# EAGLE schematic SmartLEDShield_ESP32_THT_V0 (EAGLE 8.6.3)
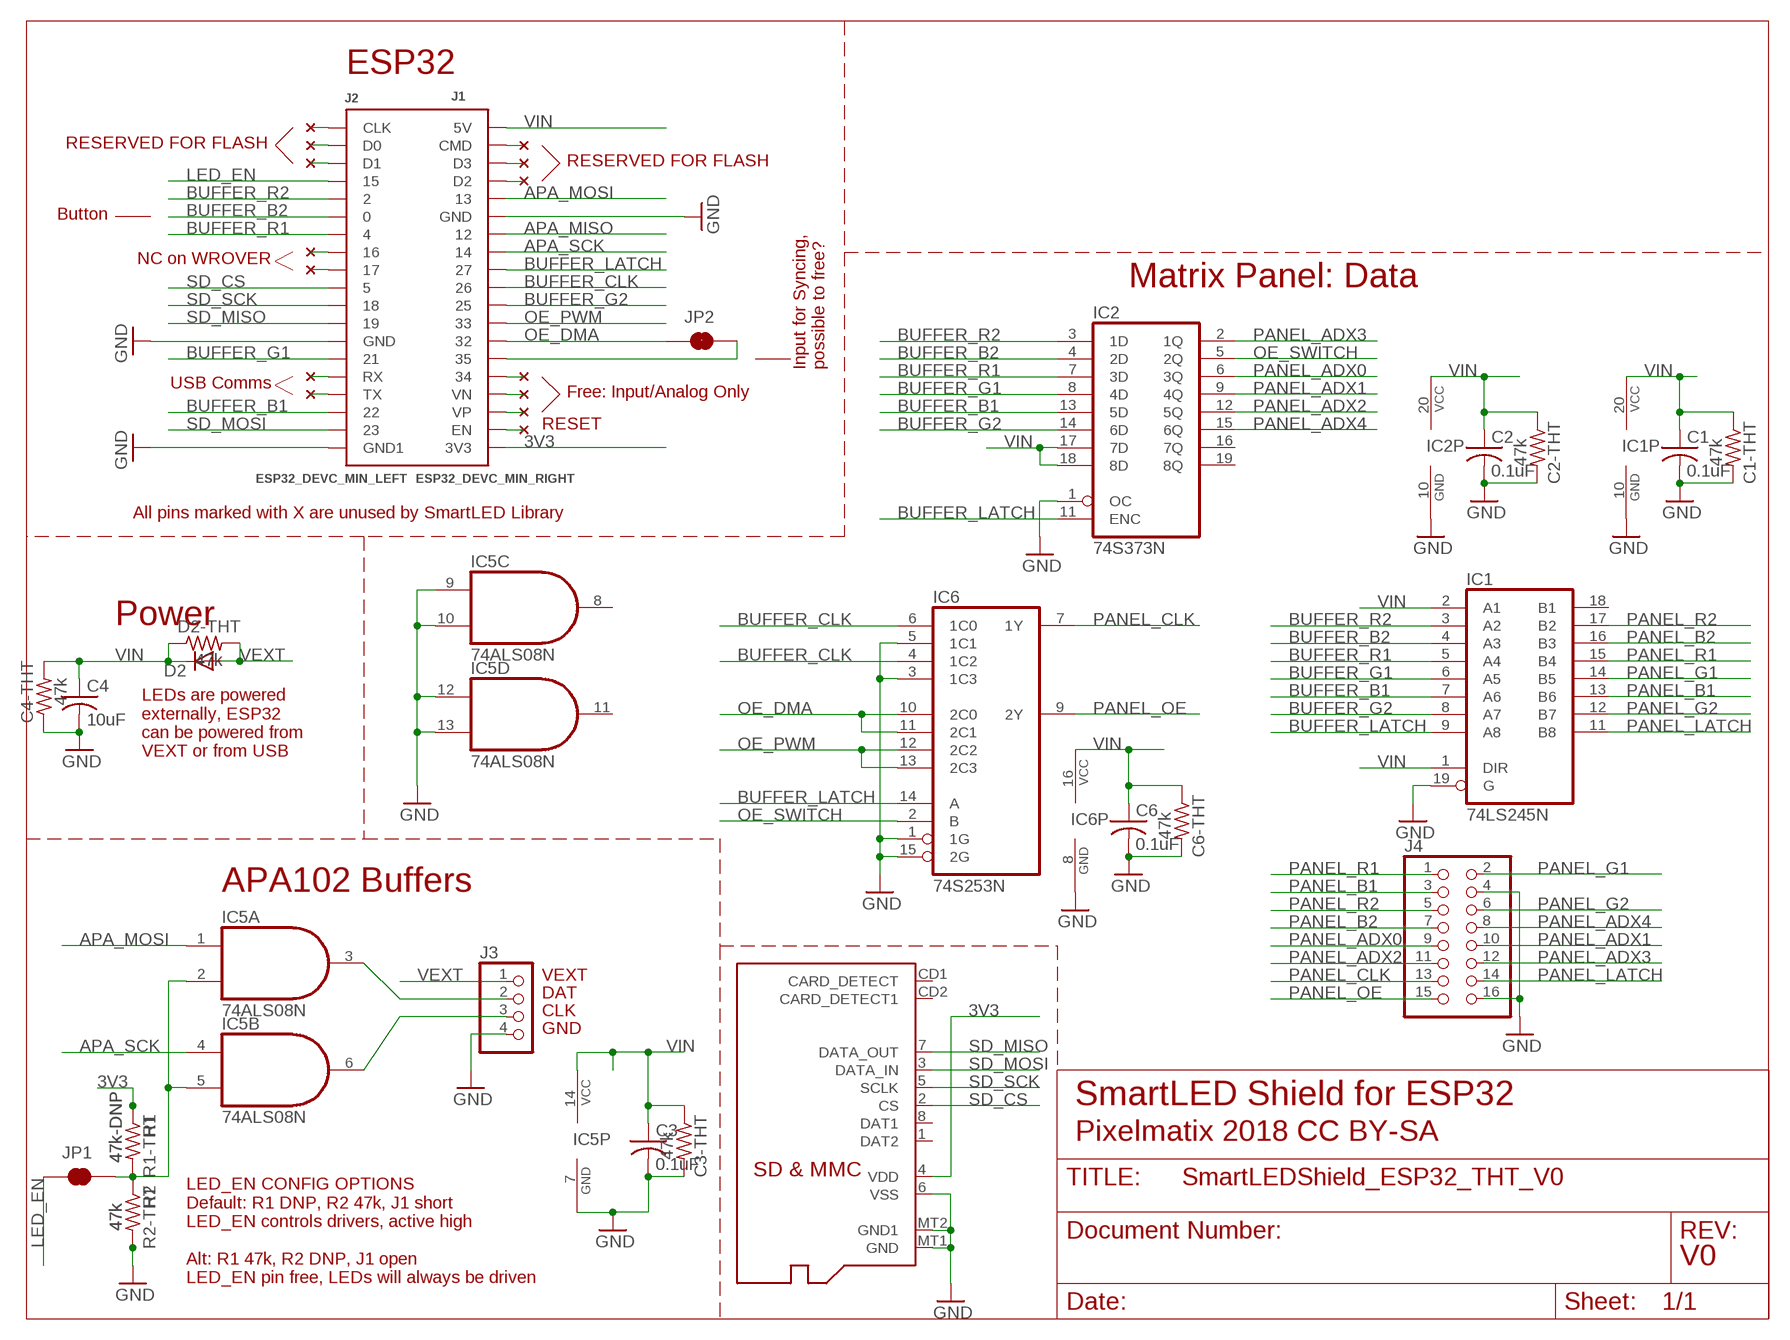
[diagram p0: schematic, sheet 1]

## Parts
C1  0.1uF  C-USC0603  [C0603]
C1-THT  47k  R-US_0204/7  [0204/7]
C2  0.1uF  C-USC0603  [C0603]
C2-THT  47k  R-US_0204/7  [0204/7]
C3  0.1uF  C-USC0603  [C0603]
C3-THT  47k  R-US_0204/7  [0204/7]
C4  10uF  C-USC0805  [C0805]
C4-THT  47k  R-US_0204/7  [0204/7]
C6  0.1uF  C-USC0603  [C0603]
C6-THT  47k  R-US_0204/7  [0204/7]
D2  MBR1020VL  [SOD123-FL]
D2-THT  47k  R-US_0204/7  [0204/7]
IC1  74LS245N  [DIL20]
IC2  74S373N  [DIL20]
IC5  74ALS08N  [DIL14]
IC6  74S253N  [DIL16]
J1  ESP32_DEVC_MIN_RIGHT  [ESP32_DEVC_DUAL_HEADER_BOT_MOUNT_RIGHT]
J2  ESP32_DEVC_MIN_LEFT  [ESP32_DEVC_DUAL_HEADER_BOT_MOUNT_LEFT]
J3  PINHD-1X04_2.54-S  [1X04-S]
J4  PINHD-2X08_SMARTMATRIX_SSMTHT  [SMARTMATRIX_SSMTHT]
J6  MICROSD  [MICROSD]
JP1  JUMPER-SMT_2_NC_TRACE_NO-SILK  [SMT-JUMPER_2_NC_TRACE_NO-SILK]
JP2  JUMPER-SMT_2_NC_TRACE_NO-SILK  [SMT-JUMPER_2_NC_TRACE_NO-SILK]
R1  47k-DNP  R-US_R0603  [R0603]
R1-THT  47k-DNP  R-US_0204/7  [0204/7]
R2  47k  R-US_R0603  [R0603]
R2-THT  47k  R-US_0204/7  [0204/7]
U$1  NC  (no package)
U$2  NC  (no package)
U$3  NC  (no package)
U$4  NC  (no package)
U$6  NC  (no package)
U$7  NC  (no package)
U$8  NC  (no package)
U$9  NC  (no package)
U$10  NC  (no package)
U$11  NC  (no package)
U$13  NC  (no package)
U$15  NC  (no package)
U$16  NC  (no package)
U$17  NC  (no package)

## Nets
3V3 [power]: J1.3V3A(3V3) J1.3V3B(3V3) J6.4(VDD) R1-THT.1 R1.1
APA_MISO: J1.12A J1.12B
APA_MOSI: IC5.1(A:I0) J1.13A_A J1.13B_B
APA_SCK: IC5.4(B:I0) J1.14A_A J1.14B_B
BUFFER_B1: IC1.7(A6) IC2.13(5D) J2.22A J2.22B
BUFFER_B2: IC1.4(A3) IC2.4(2D) J2.0A J2.0B
BUFFER_CLK: IC6.4(1C2) IC6.6(1C0) J1.26A J1.26B
BUFFER_G1: IC1.6(A5) IC2.8(4D) J2.21A J2.21B
BUFFER_G2: IC1.8(A7) IC2.14(6D) J1.25A J1.25B
BUFFER_LATCH: IC1.9(A8) IC2.11(ENC) IC6.14(A) J1.27A J1.27B
BUFFER_R1: IC1.5(A4) IC2.7(3D) J2.4A J2.4B
BUFFER_R2: IC1.3(A2) IC2.3(1D) J2.2A J2.2B
CLK1: IC5.6(B:O) J3.3
DAT1: IC5.3(A:O) J3.2
GND [power]: C1-THT.2 C1.2 C2-THT.2 C2.2 C3-THT.2 C3.2 C4-THT.1 C4.2 C6-THT.2 C6.2 IC1.10(GND) IC1.19(G) IC2.1(OC) IC2.10(GND) IC5.7(P:GND) IC5.9(C:I0) IC5.10(C:I1) IC5.12(D:I0) IC5.13(D:I1) IC6.1(1G) IC6.3(1C3) IC6.5(1C1) IC6.8(GND) IC6.15(2G) J1.GNDA(GND) J1.GNDB(GND) J2.GND1A(GND1) J2.GND1B(GND1) J2.GNDA(GND) J2.GNDB(GND) J3.4 J4.4 J4.16 J6.6(VSS) J6.MT1(GND) J6.MT2(GND1) R2-THT.2 R2.2
LED_EN: J2.15A_A J2.15B_B JP1.1
N$1: J1.35A J1.35B JP2.2
N$2: J1.CMD_A(CMD) J1.CMD_B(CMD) U$1.P$1
N$3: J1.D3_A(D3) J1.D3_B(D3) U$2.P$1
N$4: IC5.2(A:I1) IC5.5(B:I1) JP1.2 R1-THT.2 R1.2 R2-THT.1 R2.1
N$5: J1.D2A(D2) J1.D2B(D2) U$3.P$1
N$6: J2.CLKA(CLK) J2.CLKB(CLK) U$4.P$1
N$7: J2.D0A(D0) J2.D0B(D0) U$6.P$1
N$8: J2.D1A(D1) J2.D1B(D1) U$7.P$1
N$9: J1.VNA(VN) J1.VNB(VN) U$8.P$1
N$10: J1.VPA(VP) J1.VPB(VP) U$9.P$1
N$11: J1.34A J1.34B U$10.P$1
N$13: J1.ENA(EN) J1.ENB(EN) U$11.P$1
N$14: J2.TXA(TX) J2.TXB(TX) U$13.P$1
N$15: J2.RXA(RX) J2.RXB(RX) U$15.P$1
N$16: J2.17A_A J2.17B_B U$16.P$1
N$17: J2.16_B J2.16A_A U$17.P$1
OE_DMA: IC6.10(2C0) IC6.11(2C1) J1.32A J1.32B JP2.1
OE_PWM: IC6.12(2C2) IC6.13(2C3) J1.33A J1.33B
OE_SWITCH: IC2.5(2Q) IC6.2(B)
PANEL_ADX0: IC2.6(3Q) J4.9
PANEL_ADX1: IC2.9(4Q) J4.10
PANEL_ADX2: IC2.12(5Q) J4.11
PANEL_ADX3: IC2.2(1Q) J4.12
PANEL_ADX4: IC2.15(6Q) J4.8
PANEL_B1: IC1.13(B6) J4.3
PANEL_B2: IC1.16(B3) J4.7
PANEL_CLK: IC6.7(1Y) J4.13
PANEL_G1: IC1.14(B5) J4.2
PANEL_G2: IC1.12(B7) J4.6
PANEL_LATCH: IC1.11(B8) J4.14
PANEL_OE: IC6.9(2Y) J4.15
PANEL_R1: IC1.15(B4) J4.1
PANEL_R2: IC1.17(B2) J4.5
SD_CS: J2.5A J2.5B J6.2(CS)
SD_MISO: J2.19A_A J2.19B_B J6.7(DATA_OUT)
SD_MOSI: J2.23A J2.23B J6.3(DATA_IN)
SD_SCK: J2.18A_A J2.18B_B J6.5(SCLK)
VEXT [power]: D2-THT.2 D2.A J3.1
VIN [power]: C1-THT.1 C1.1 C2-THT.1 C2.1 C3-THT.1 C3.1 C4-THT.2 C4.1 C6-THT.1 C6.1 D2-THT.1 D2.C IC1.1(DIR) IC1.2(A1) IC1.20(VCC) IC2.17(7D) IC2.18(8D) IC2.20(VCC) IC5.14(P:VCC) IC6.16(VCC) J1.5V_A(5V) J1.5V_B(5V)
Unconnected: IC1.18(B1) IC2.16(7Q) IC2.19(8Q) IC5.8(C:O) IC5.11(D:O) J6.1(DAT2) J6.8(DAT1) J6.CD1(CARD_DETECT) J6.CD2(CARD_DETECT1)

## Notes on the sheet
- ESP32
- RESERVED FOR FLASH
- RESERVED FOR FLASH
- Button
- NC on WROVER
- Matrix Panel: Data
- Input for Syncing,
  possible to free?
- USB Comms
- Free: Input/Analog Only
- RESET
- All pins marked with X are unused by SmartLED Library
- Power
- LEDs are powered
  externally, ESP32
  can be powered from
  VEXT or from USB
- APA102 Buffers
- VEXT
- DAT
- CLK
- GND
- SmartLED Shield for ESP32
- Pixelmatix 2018 CC BY-SA
- V0
- LED_EN CONFIG OPTIONS
  Default: R1 DNP, R2 47k, J1 short
  LED_EN controls drivers, active high
  
  Alt: R1 47k, R2 DNP, J1 open
  LED_EN pin free, LEDs will always be driven

## Library data of the parts
C1-C4 C6 = scanlime:C-US: CAPACITOR, American symbol; PARTNO: CAP CER 0.1UF 10V 10% X7R 0805
C1-THT C2-THT C3-THT C4-THT C6-THT D2-THT R1 R1-THT R2 R2-THT = rcl:R-US_: RESISTOR, American symbol
D2 = eclibrary:MBR1020VL
IC1 = eclibrary:74*245: Octal BUS TRANSCEIVER, 3-state
IC2 = eclibrary:74*373: Octal D type transparent LATCH, edge triggered
IC5 = 74xx-us:74*08: Quad 2-input AND gate
IC6 = 74xx-us:74*253: Dual 4-to 1 line data SELECTOR/MULTIPLEXER, 3-state
J1 = eclibrary:ESP32_DEVC_MIN_RIGHT
J2 = eclibrary:ESP32_DEVC_MIN_LEFT
J3 = eclibrary:PINHD-1X04: PIN HEADER
J4 = eclibrary:PINHD-2X08: PIN HEADER
J6 = adafruit:MICROSD: Micro-SD / Transflash card holder with SPI pinout For the 3M # 2908-05WB-MG and/or 4UCON #19656 push-push type; PARTNO: 101-00660-68-6
JP1 JP2 = SparkFun-Jumpers:JUMPER-SMT_2_NC_TRACE: Normally closed trace jumper This jumper has a trace between two pads so it's normally closed (NC). Use a razor knife to open the connection. For best results follow the IPC guidelines for cutting traces: Cutout at least 0.063 mm (0.005 in). Remove all loose material to clean up the cut area. Seal the cut with an approved epoxy. Reapply solder to reclose the connection.
U$1-U$4 U$6-U$11 U$13 U$15-U$17 = eclibrary:NC

## Net classes
0 default: width 0.254 mm
1 power: width 0.406 mm